# EAGLE design Anu-Control-revC (EAGLE 5.09)
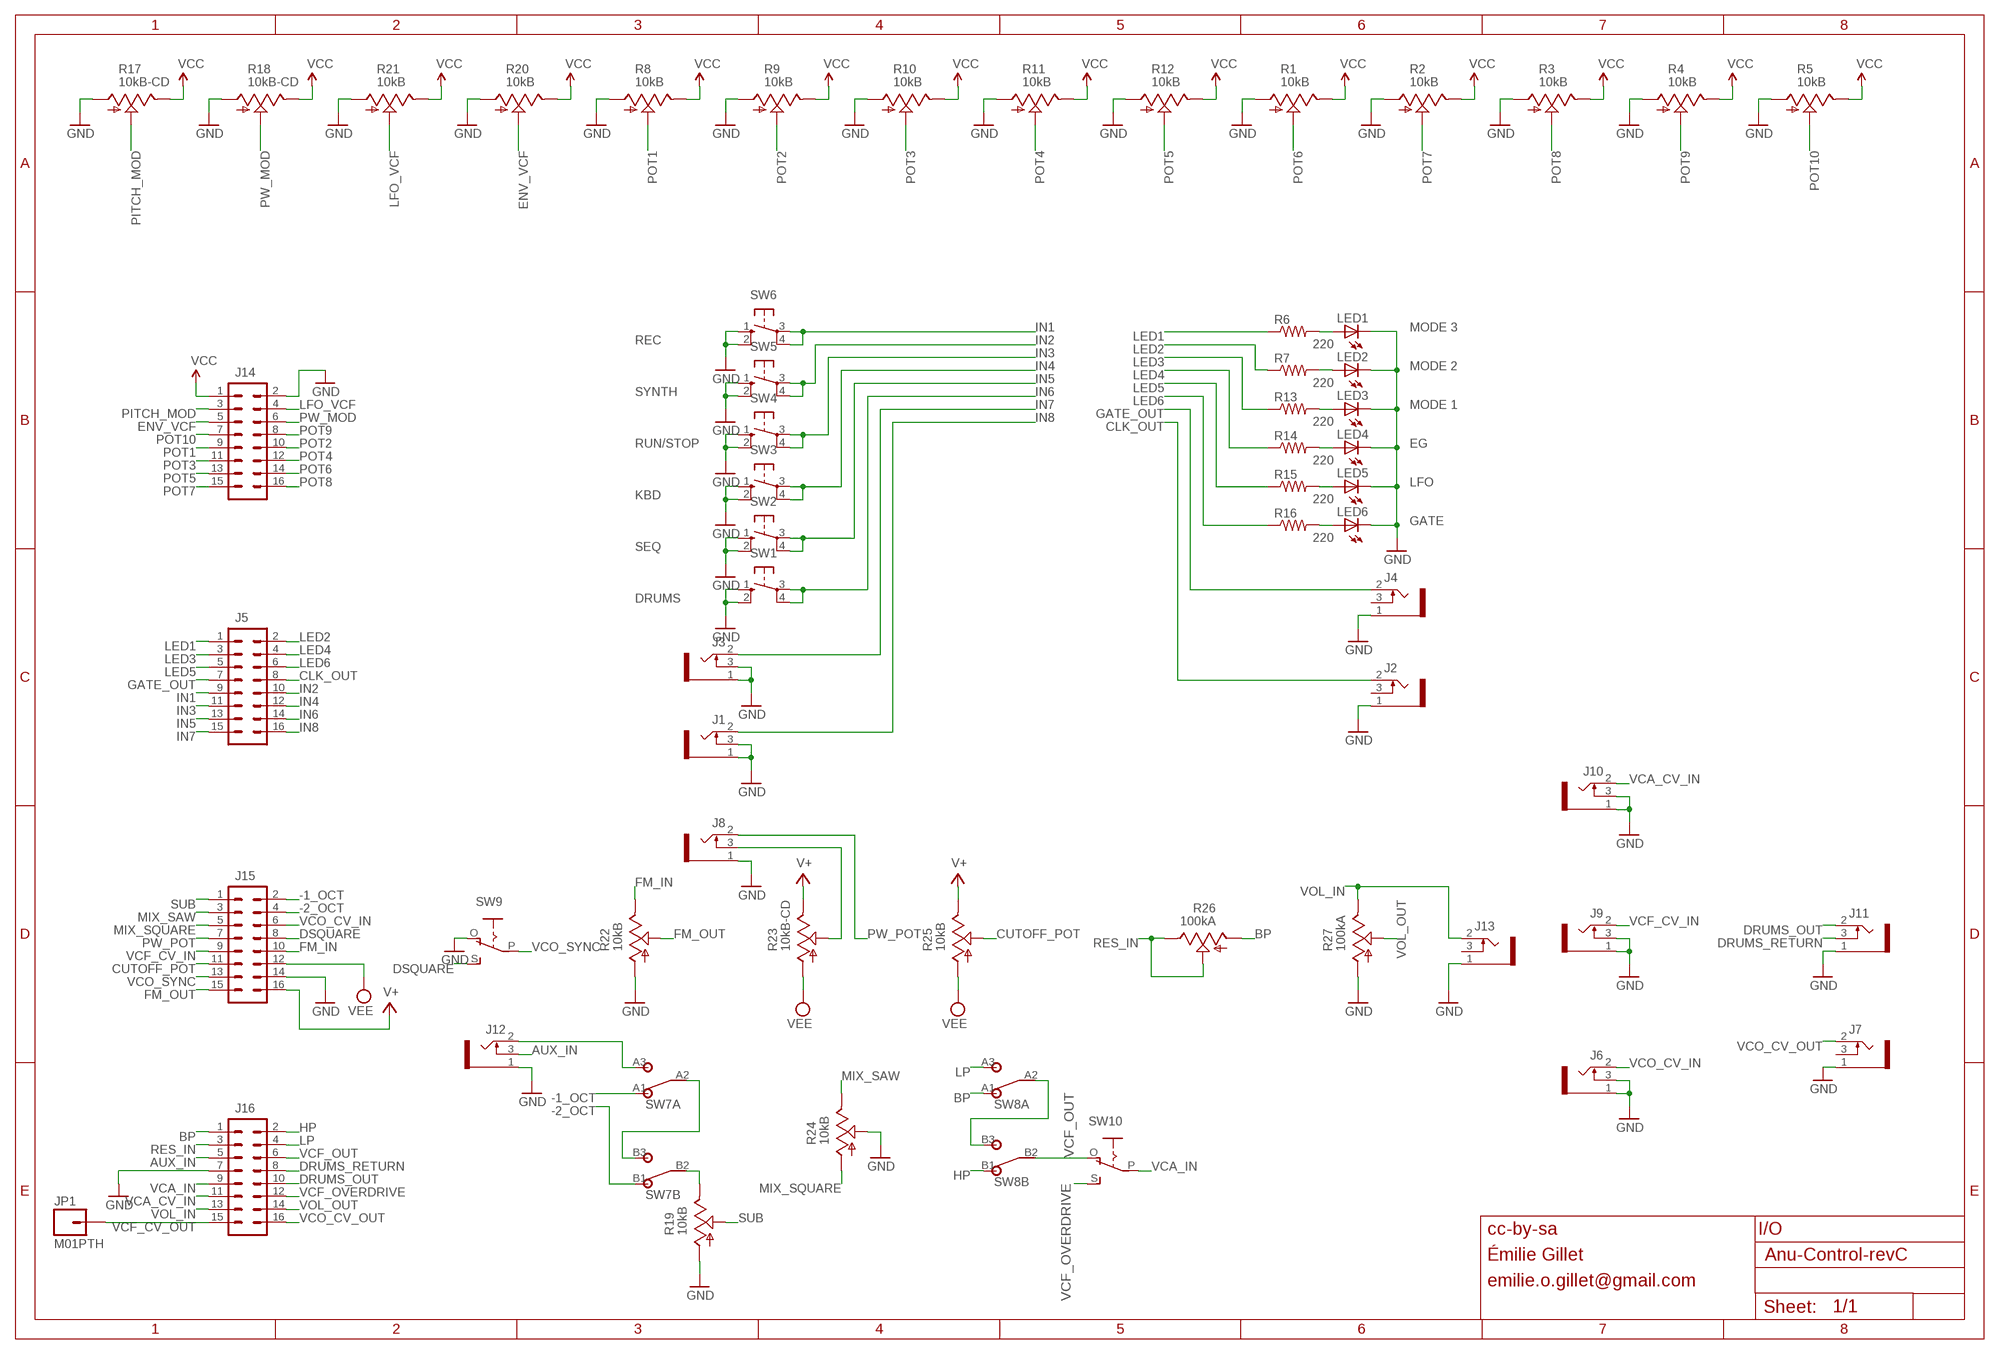
[diagram p0: schematic, sheet 1]

## Parts
J1  1502_03SLOTTED  [1502_03_SLOTTED]
J2  1502_03SLOTTED  [1502_03_SLOTTED]
J3  1502_03SLOTTED  [1502_03_SLOTTED]
J4  1502_03SLOTTED  [1502_03_SLOTTED]
J5  M08X2  [2X8]
J6  1502_03SLOTTED  [1502_03_SLOTTED]
J7  1502_03SLOTTED  [1502_03_SLOTTED]
J8  1502_03SLOTTED  [1502_03_SLOTTED]
J9  1502_03SLOTTED  [1502_03_SLOTTED]
J10  1502_03SLOTTED  [1502_03_SLOTTED]
J11  1502_03SLOTTED  [1502_03_SLOTTED]
J12  1502_03SLOTTED  [1502_03_SLOTTED]
J13  1502_03SLOTTED  [1502_03_SLOTTED]
J14  M08X2  [2X8]
J15  M08X2  [2X8]
J16  M08X2  [2X8]
JP1  M01PTH  [1X01]
LED1  LED3MM  [LED3MM]
LED2  LED3MM  [LED3MM]
LED3  LED3MM  [LED3MM]
LED4  LED3MM  [LED3MM]
LED5  LED3MM  [LED3MM]
LED6  LED3MM  [LED3MM]
R1  10kB  POT_USVERTICAL  [ALPS_POT_VERTICAL]
R2  10kB  POT_USVERTICAL  [ALPS_POT_VERTICAL]
R3  10kB  POT_USVERTICAL  [ALPS_POT_VERTICAL]
R4  10kB  POT_USVERTICAL  [ALPS_POT_VERTICAL]
R5  10kB  POT_USVERTICAL  [ALPS_POT_VERTICAL]
R6  220  R-US_0204/7  [0204/7]
R7  220  R-US_0204/7  [0204/7]
R8  10kB  POT_USVERTICAL  [ALPS_POT_VERTICAL]
R9  10kB  POT_USVERTICAL  [ALPS_POT_VERTICAL]
R10  10kB  POT_USVERTICAL  [ALPS_POT_VERTICAL]
R11  10kB  POT_USVERTICAL  [ALPS_POT_VERTICAL]
R12  10kB  POT_USVERTICAL  [ALPS_POT_VERTICAL]
R13  220  R-US_0204/7  [0204/7]
R14  220  R-US_0204/7  [0204/7]
R15  220  R-US_0204/7  [0204/7]
R16  220  R-US_0204/7  [0204/7]
R17  10kB-CD  POT_USVERTICAL  [ALPS_POT_VERTICAL]
R18  10kB-CD  POT_USVERTICAL  [ALPS_POT_VERTICAL]
R19  10kB  POT_USVERTICAL  [ALPS_POT_VERTICAL]
R20  10kB  POT_USVERTICAL  [ALPS_POT_VERTICAL]
R21  10kB  POT_USVERTICAL  [ALPS_POT_VERTICAL]
R22  10kB  POT_USVERTICAL  [ALPS_POT_VERTICAL]
R23  10kB-CD  POT_USVERTICAL  [ALPS_POT_VERTICAL]
R24  10kB  POT_USVERTICAL  [ALPS_POT_VERTICAL]
R25  10kB  POT_USVERTICAL  [ALPS_POT_VERTICAL]
R26  100kA  POT_USVERTICAL  [ALPS_POT_VERTICAL]
R27  100kA  POT_USVERTICAL  [ALPS_POT_VERTICAL]
SW1  40-XX  [B3F-40XX]
SW2  40-XX  [B3F-40XX]
SW3  40-XX  [B3F-40XX]
SW4  40-XX  [B3F-40XX]
SW5  40-XX  [B3F-40XX]
SW6  40-XX  [B3F-40XX]
SW7  DPDT2MD6T2B2M2RE  [DPDT_MINI]
SW8  DPDT2MD6T2B2M2RE  [DPDT_MINI]
SW9  EG1218S  [EG1218]
SW10  EG1218S  [EG1218]

## Nets
-1_OCT: J15.2 SW7.A1
-2_OCT: J15.4 SW7.B1
AUX_IN: J12.3 J16.5
BP: J16.1 R26.P$3(A) SW8.A1
CLK_OUT: J2.2 J5.8
CUTOFF_POT: J15.11 R25.P$2(S)
DRUMS_OUT: J11.2 J16.10
DRUMS_RETURN: J11.3 J16.8
DSQUARE: J15.8 SW9.S
ENV_VCF: J14.5 R20.P$2(S)
FM_IN: J15.10 R22.P$1(E)
FM_OUT: J15.15 R22.P$2(S)
GATE_OUT: J4.2 J5.7
GND: J1.1 J1.3 J2.1 J3.1 J3.3 J4.1 J6.1 J6.3 J7.1 J8.1 J9.1 J9.3 J10.1 J10.3 J11.1 J12.1 J13.1 J14.2 J15.14 J16.7 LED1.K(C) LED2.K(C) LED3.K(C) LED4.K(C) LED5.K(C) LED6.K(C) R1.P$3(A) R2.P$3(A) R3.P$3(A) R4.P$3(A) R5.P$3(A) R8.P$3(A) R9.P$3(A) R10.P$3(A) R11.P$3(A) R12.P$3(A) R17.P$3(A) R18.P$3(A) R19.P$3(A) R20.P$3(A) R21.P$3(A) R22.P$3(A) R24.P$2(S) R27.P$3(A) SW1.1(S) SW1.2(S1) SW2.1(S) SW2.2(S1) SW3.1(S) SW3.2(S1) SW4.1(S) SW4.2(S1) SW5.1(S) SW5.2(S1) SW6.1(S) SW6.2(S1) SW9.O
HP: J16.2 SW8.B1
IN1: J5.9 SW6.3(P) SW6.4(P1)
IN2: J5.10 SW5.3(P) SW5.4(P1)
IN3: J5.11 SW4.3(P) SW4.4(P1)
IN4: J5.12 SW3.3(P) SW3.4(P1)
IN5: J5.13 SW2.3(P) SW2.4(P1)
IN6: J5.14 SW1.3(P) SW1.4(P1)
IN7: J3.2 J5.15
IN8: J1.2 J5.16
LED1: J5.1 R6.1
LED2: J5.2 R7.1
LED3: J5.3 R13.1
LED4: J5.4 R14.1
LED5: J5.5 R15.1
LED6: J5.6 R16.1
LFO_VCF: J14.4 R21.P$2(S)
LP: J16.4 SW8.A3
MIX_SAW: J15.3 R24.P$1(E)
MIX_SQUARE: J15.5 R24.P$3(A)
N$1: J8.3 R23.P$2(S)
N$2: R19.P$1(E) SW7.B2
N$10: J12.2 SW7.A3
N$36: SW8.A2 SW8.B3
N$42: LED1.A R6.2
N$43: LED2.A R7.2
N$44: LED3.A R13.2
N$45: LED4.A R14.2
N$46: LED5.A R15.2
N$47: LED6.A R16.2
N$65: SW7.A2 SW7.B3
PITCH_MOD: J14.3 R17.P$2(S)
POT1: J14.9 R8.P$2(S)
POT2: J14.10 R9.P$2(S)
POT3: J14.11 R10.P$2(S)
POT4: J14.12 R11.P$2(S)
POT5: J14.13 R12.P$2(S)
POT6: J14.14 R1.P$2(S)
POT7: J14.15 R2.P$2(S)
POT8: J14.16 R3.P$2(S)
POT9: J14.8 R4.P$2(S)
POT10: J14.7 R5.P$2(S)
PW_MOD: J14.6 R18.P$2(S)
PW_POT: J8.2 J15.7
RES_IN: J16.3 R26.P$1(E) R26.P$2(S)
SUB: J15.1 R19.P$2(S)
V+: J15.16 R23.P$1(E) R25.P$1(E)
VCA_CV_IN: J10.2 J16.11
VCA_IN: J16.9 SW10.P
VCC: J14.1 R1.P$1(E) R2.P$1(E) R3.P$1(E) R4.P$1(E) R5.P$1(E) R8.P$1(E) R9.P$1(E) R10.P$1(E) R11.P$1(E) R12.P$1(E) R17.P$1(E) R18.P$1(E) R20.P$1(E) R21.P$1(E)
VCF_CV_IN: J9.2 J15.9
VCF_CV_OUT: J16.15 JP1.1
VCF_OUT: J16.6 SW8.B2 SW10.O
VCF_OVERDRIVE: J16.12 SW10.S
VCO_CV_IN: J6.2 J15.6
VCO_CV_OUT: J7.2 J16.16
VCO_SYNC: J15.13 SW9.P
VEE: J15.12 R23.P$3(A) R25.P$3(A)
VOL_IN: J13.2 J16.13 R27.P$1(E)
VOL_OUT: J16.14 R27.P$2(S)
Unconnected: J2.3 J4.3 J7.3 J13.3

## Notes on the sheet
- MODE 3
- REC
- MODE 2
- SYNTH
- MODE 1
- RUN/STOP | EG
- LFO
- KBD
- GATE
- SEQ
- DRUMS
- cc-by-sa | I/O
- Émilie Gillet
- emilie.o.gillet@gmail.com

## Library data of the parts
J1-J4 J6-J13 = og-lumberg:1502_03
J5 J14-J16 = SparkFun:M08X2
JP1 = SparkFun:M01: Header 1 Standard 1-pin 0.1" header. Use with straight break away headers (SKU : PRT-00116), right angle break away headers (PRT-00553), swiss pins (PRT-00743), machine pins (PRT-00117), and female headers (PRT-00115).
LED1-LED6 = led:LED: LED OSRAM: - CHIPLED LG R971, LG N971, LY N971, LG Q971, LY Q971, LO R971, LY R971 LH N974, LH R974 LS Q976, LO Q976, LY Q976 LO Q996 - Hyper CHIPLED LW Q18S LB Q993, LB Q99A, LB R99A - SideLED LS A670, LO A670, LY A670, LG A670, LP A670 LB A673, LV A673, LT A673, LW A673 LH A674 LY A675 LS A676, LA A676, LO A676, LY A676, LW A676 LS A679, LY A679, LG A679 - Hyper Micro SIDELED® LS Y876, LA Y876, LO Y876, LY Y876 LT Y87S - SmartLED LW L88C, LW L88S LB L89C, LB L89S, LG L890 LS L89K, LO L89K, LY L89K LS L896, LA L896, LO L896, LY L896 - TOPLED LS T670, LO T670, LY T670, LG T670, LP T670 LSG T670, LSP T670, LSY T670, LOP T670, LYG T670 LG T671, LOG T671, LSG T671 LB T673, LV T673, LT T673, LW T673 LH T674 LS T676, LA T676, LO T676, LY T676, LB T676, LH T676, LSB T676, LW T676 LB T67C, LV T67C, LT T67C, LS T67K, LO T67K, LY T67K, LW E67C LS E67B, LA E67B, LO E67B, LY E67B, LB E67C, LV E67C, LT E67C LW T67C LS T679, LY T679, LG T679 LS T770, LO T770, LY T770, LG T770, LP T770 LB T773, LV T773, LT T773, LW T773 LH T774 LS E675, LA E675, LY E675, LS T675 LS T776, LA T776, LO T776, LY T776, LB T776 LHGB T686 LT T68C, LB T68C - Hyper Mini TOPLED® LB M676 - Mini TOPLED Santana® LG M470 LS M47K, LO M47K, LY M47K Source: http://www.osram.convergy.de LUXEON: - LUMILED® LXK2-PW12-R00, LXK2-PW12-S00, LXK2-PW14-U00, LXK2-PW14-V00 LXK2-PM12-R00, LXK2-PM12-S00, LXK2-PM14-U00 LXK2-PE12-Q00, LXK2-PE12-R00, LXK2-PE12-S00, LXK2-PE14-T00, LXK2-PE14-U00 LXK2-PB12-K00, LXK2-PB12-L00, LXK2-PB12-M00, LXK2-PB14-N00, LXK2-PB14-P00, LXK2-PB14-Q00 LXK2-PR12-L00, LXK2-PR12-M00, LXK2-PR14-Q00, LXK2-PR14-R00 LXK2-PD12-Q00, LXK2-PD12-R00, LXK2-PD12-S00 LXK2-PH12-R00, LXK2-PH12-S00 LXK2-PL12-P00, LXK2-PL12-Q00, LXK2-PL12-R00 Source: www.luxeon.com KINGBRIGHT: KA-3528ASYC Source: www.kingbright.com
R1-R5 R8-R12 R17-R27 = pot-alps:POT_US
R6 R7 R13-R16 = rcl:R-US_: RESISTOR, American symbol
SW1-SW6 = og-switch:40-XX: OMRON SWITCH
SW7 SW8 = og-switch:DPDT
SW9 SW10 = adafruit:EG1218: SLIDING SWITCH 0.1" spacing through hole, vertical SPDT slide switch http://www.ladyada.net/library/pcb/eaglelibrary.html

## Board
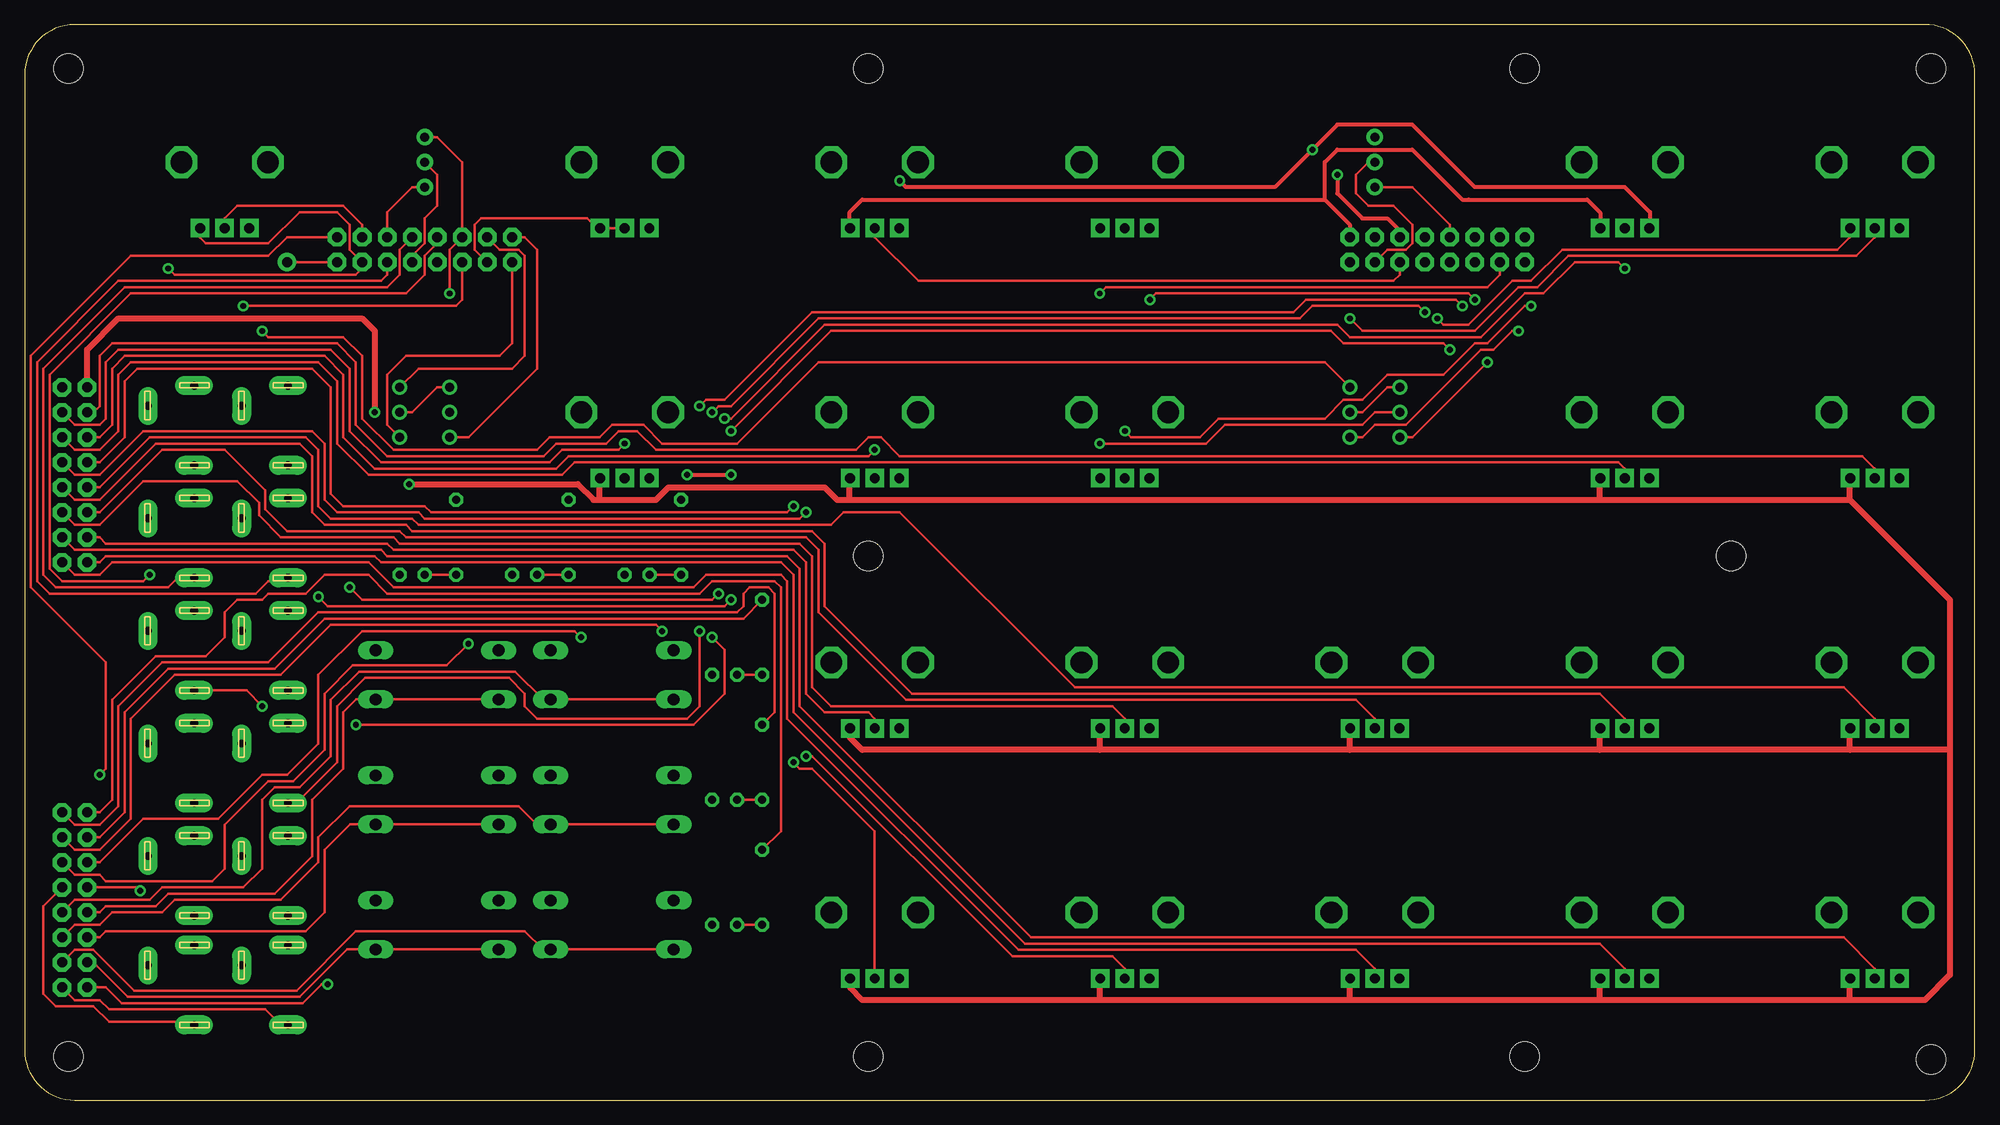
[diagram p1: board, top side]
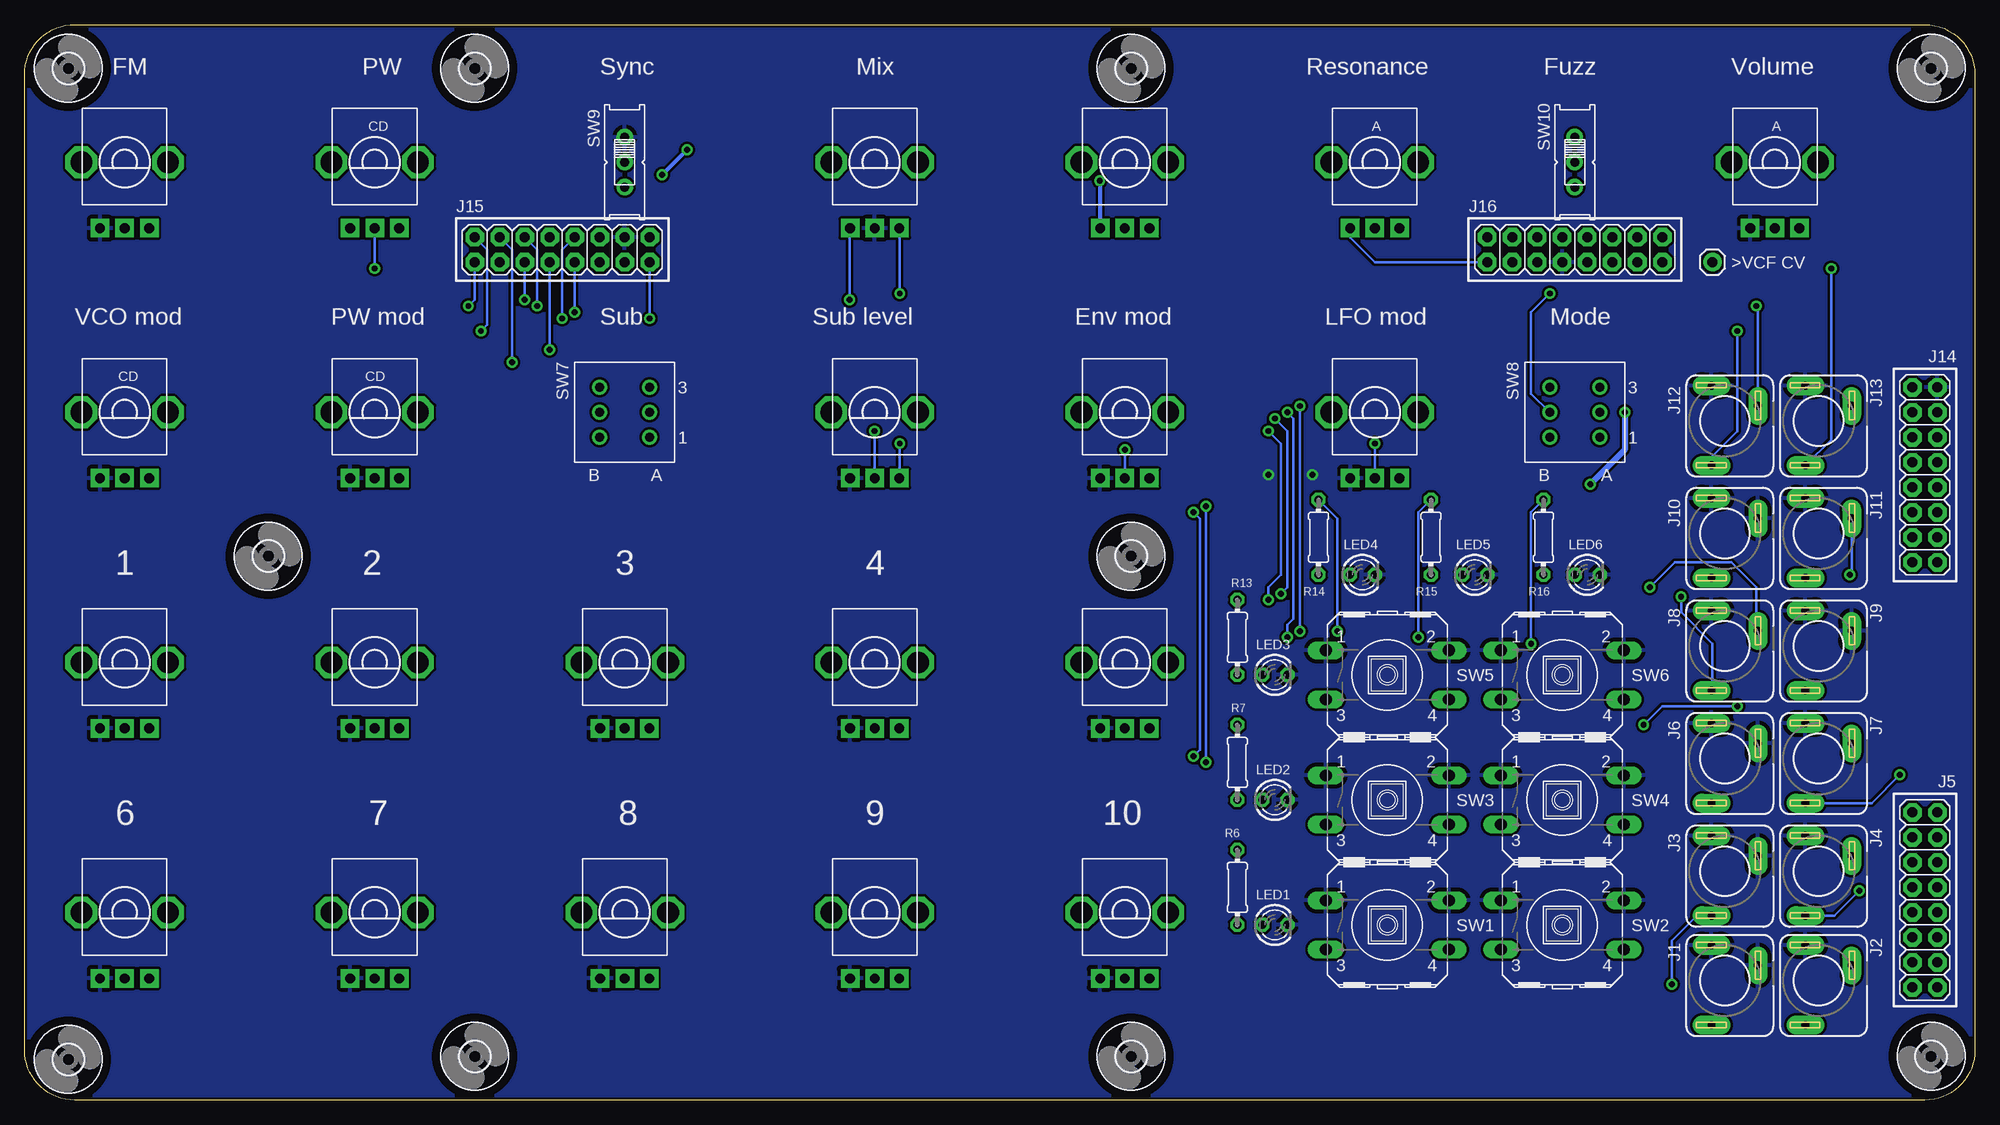
[diagram p2: board, bottom side, seen from below]

Size 198.12 x 109.22 mm. Coordinates in mm from the lower left corner, seen from the top.
Outline: 5.08,109.22 arc90 0,104.14 0,5.08 arc90 5.08,0 193.04,0 arc90 198.12,5.08 198.12,104.14 arc90 193.04,109.22 5.08,109.22
Copper layers (1*16): Top 0.035mm / dielectric 1.5mm / Bottom 0.035mm
Design rules "SparkFun *": minimum track width 8mil, minimum drill 20mil, track to track 8mil, track to pad 8mil, pad to pad 8mil, via to via 8mil, smd to smd 8mil, copper to edge 10mil, drill to drill 8mil, minimum pad ring 12mil, minimum via ring 10mil, stop-mask expansion 4mil, vias tented up to drill 25mil, thermal gap 16mil

### Footprints (pad centres in the part's own frame; a part is rotated, then mirrored left to right if it is on the bottom)
1502_03_SLOTTED = drill 0.8 pad 1.93 long: 1 1.35,-3.34; 2 1.35,4.76; 3 -3.35,-1.29
2X8 = drill 1.016 pad 1.88 octagon: 1 0,0; 2 0,2.54; 3 2.54,0; 4 2.54,2.54; 5 5.08,0; 6 5.08,2.54; 7 7.62,0; 8 7.62,2.54; 9 10.16,0; 10 10.16,2.54; 11 12.7,0; 12 12.7,2.54; 13 15.24,0; 14 15.24,2.54; 15 17.78,0; 16 17.78,2.54
1X01 = drill 1.016 pad 1.88 round: 1 0,0
LED3MM = drill 0.813 octagon: A -1.27,0; K 1.27,0
ALPS_POT_VERTICAL = drill 1 pad 1.88 square: P$1 -2.5,6.7; P$2 0,6.7; P$3 2.5,6.7 | drill 2.2 pad 3.175 octagon: P$4 -4.4,0; P$5 4.4,0
0204/7 = drill 0.813 octagon: 1 -3.81,0; 2 3.81,0
B3F-40XX = drill 1.194 long: 1 -6.248,2.489; 2 6.248,2.489; 3 -6.248,-2.489; 4 6.248,-2.489
DPDT_MINI = drill 0.9 round: A1 -2.54,2.54; A2 -2.54,0; A3 -2.54,-2.54; B1 2.54,2.54; B2 2.54,0; B3 2.54,-2.54
EG1218 = drill 0.9 pad 1.676 round: O -2.54,0; P 0,0; S 2.54,0
3,0 = hole 3: 0,0

### Placement (x,y rotation side)
J1  25.4,12.38 180 bottom
J2  15.88,12.38 180 bottom
J3  25.4,23.5 180 bottom
J4  15.88,23.5 180 bottom
J5  6.35,29.21 270 bottom
J6  25.4,34.92 180 bottom
J7  15.88,34.92 180 bottom
J8  25.4,46.35 180 bottom
J9  15.88,46.35 180 bottom
J10  25.4,57.78 180 bottom
J11  15.88,57.78 180 bottom
J12  25.4,69.22 180 bottom
J13  15.88,69.22 180 bottom
J14  6.35,72.39 270 bottom
J15  152.4,85.09 0 bottom
J16  49.53,85.09 0 bottom
JP1  26.67,85.09 0 bottom
LED1  71.12,17.78 0 bottom
LED2  71.12,30.48 0 bottom
LED3  71.12,43.18 0 bottom
LED4  62.23,53.34 0 bottom
LED5  50.8,53.34 0 bottom
LED6  39.37,53.34 0 bottom
R1  187.96,19.05 180 bottom
R2  162.56,19.05 180 bottom
R3  137.16,19.05 180 bottom
R4  111.76,19.05 180 bottom
R5  86.36,19.05 180 bottom
R6  74.93,21.59 270 bottom
R7  74.93,34.29 270 bottom
R8  187.96,44.45 180 bottom
R9  162.56,44.45 180 bottom
R10  137.16,44.45 180 bottom
R11  111.76,44.45 180 bottom
R12  86.36,44.45 180 bottom
R13  74.93,46.99 270 bottom
R14  66.67,57.15 270 bottom
R15  55.24,57.15 270 bottom
R16  43.81,57.15 270 bottom
R17  187.96,69.85 180 bottom
R18  162.56,69.85 180 bottom
R19  111.76,69.85 180 bottom
R20  86.36,69.85 180 bottom
R21  60.96,69.85 180 bottom
R22  187.96,95.25 180 bottom
R23  162.56,95.25 180 bottom
R24  111.76,95.25 180 bottom
R25  86.36,95.25 180 bottom
R26  60.96,95.25 180 bottom
R27  20.32,95.25 180 bottom
SW1  59.69,17.78 0 bottom
SW2  41.91,17.78 0 bottom
SW3  59.69,30.48 0 bottom
SW4  41.91,30.48 0 bottom
SW5  59.69,43.18 0 bottom
SW6  41.91,43.18 0 bottom
SW7  137.16,69.85 180 bottom
SW8  40.64,69.85 180 bottom
SW9  137.16,95.25 270 bottom
SW10  40.64,95.25 270 bottom
U$1  [3,0]  193.68,4.13 0 bottom
U$2  [3,0]  152.4,4.45 0 bottom
U$3  [3,0]  85.72,4.45 0 bottom
U$4  [3,0]  4.45,4.45 0 bottom
U$5  [V2_LOGO_ANUSHRI_CONTROL_BOARD]  82.23,0.64 0 bottom
U$6  [3,0]  173.35,55.24 0 bottom
U$7  [3,0]  85.72,55.24 0 bottom
U$8  [3,0]  193.68,104.78 0 bottom
U$9  [3,0]  152.4,104.78 0 bottom
U$10  [3,0]  85.72,104.78 0 bottom
U$11  [3,0]  4.45,104.78 0 bottom

### Tracks (layer width: path | path; a pad name or v marks a point on that pad's centre or on a via)
-1_OCT  (via drill 0.6)
  Top 0.254: SW7.A1 135.89,67.31 137.16,68.58 140.34,68.58 147.96,76.2 149.22,76.2 151.13,78.11 v151.76,78.11
  Bottom 0.254: v151.76,78.11 151.13,78.74 151.13,86.36 J15.2
-2_OCT  (via drill 0.6)
  Top 0.254: SW7.B1 140.97,67.31 v148.59,74.93
  Bottom 0.254: v148.59,74.93 148.59,86.36 J15.4
AUX_IN  (via drill 0.6)
  Top 0.254: v22.23,80.64 43.81,80.64 44.45,81.28 J16.5
  Bottom 0.254: v22.23,80.64 22.05,80.47 J12.3
BP
  Top 0.254: SW8.A1 36.83,68.58 36.83,73.66 38.73,75.56 48.26,75.56 49.53,76.83 J16.1
  Bottom 0.254: J16.1 60.96,85.09 63.46,87.59 R26.P$3
CLK_OUT
  Top 0.254: J5.8 1.91,19.68 1.91,10.79 3.17,9.53 6.99,9.53 8.57,7.94 16.19,7.94 16.51,7.62 J2.2
CUTOFF_POT
  Top 0.254: R25.P$2 86.36,87.63 90.81,83.19 139.06,83.19 139.7,83.82 J15.11
DRUMS_OUT
  Top 0.254: J16.10 38.1,86.36 38.1,83.82 36.83,82.55 10.16,82.55 1.91,74.3 1.91,53.34 3.17,52.07 14.61,52.07 15.56,53.02 J11.2
DRUMS_RETURN  (via drill 0.6)
  Top 0.254: v12.7,53.34 12.06,52.7 3.81,52.7 2.54,53.98 2.54,73.66 10.79,81.92 38.73,81.92 40.64,83.82 40.64,85.72 41.91,87 J16.8
  Bottom 0.254: v12.7,53.34 12.53,53.52 J11.3
DSQUARE
  Top 0.254: J15.8 144.78,88.9 140.97,92.71 SW9.S
ENV_VCF  (via drill 0.6)
  Top 0.254: v86.36,66.04 85.72,65.41 55.24,65.41 53.98,64.14 35.56,64.14 32.38,67.31 32.38,73.66 30.48,75.56 10.16,75.56 8.89,74.3 8.89,68.58 7.62,67.31 J14.5
  Bottom 0.254: v86.36,66.04 R20.P$2
FM_IN  (via drill 0.6)
  Top 0.254: R22.P$1 185.42,88.51 185.42,87.63 184.15,86.36 156.21,86.36 153.03,83.19 151.13,83.19 146.69,78.74 144.15,78.74 v143.51,79.38
  Bottom 0.254: v143.51,79.38 143.51,86.36 J15.10
FM_OUT  (via drill 0.6)
  Top 0.254: R22.P$2 187.96,87.63 186.06,85.72 156.84,85.72 153.67,82.55 151.76,82.55 147.32,78.11 135.89,78.11 v134.62,79.38
  Bottom 0.254: v134.62,79.38 J15.15
GATE_OUT  (via drill 0.6)
  Top 0.254: J5.7 11.43,21.59 v11.75,21.27
  Bottom 0.254: v11.75,21.27 14.29,18.73 J4.2
GND  (via drill 0.6)
  Top 0.406: v67.31,63.5 v71.75,63.5
  pour Bottom (isolate 0.254): 193.04,0 arc90 198.12,5.08 198.12,104.14 arc90 193.04,109.22 5.08,109.22 arc90 0,104.14 0,5.08 arc90 5.08,0
HP
  Top 0.254: SW8.B1 45.09,67.31 52.07,74.3 52.07,86.36 50.8,87.63 J16.2
IN1
  Top 0.254: SW6.3 SW6.4 33.71,40.69 32.38,39.37 32.38,33.66 29.21,30.48 29.21,24.77 25.4,20.95 14.61,20.95 13.34,19.68 8.26,19.68 7.62,19.05 J5.9
IN2
  Top 0.254: SW5.3 SW5.4 52.65,40.69 49.85,43.5 33.97,43.5 31.11,40.64 31.11,34.92 27.94,31.75 25.4,31.75 24.13,30.48 24.13,23.5 22.23,21.59 13.97,21.59 12.7,20.32 5.08,20.32 J5.10
IN3
  Top 0.254: SW4.3 SW4.4 33.07,27.99 30.48,25.4 30.48,19.05 28.57,17.14 8.26,17.14 7.62,16.51 J5.11
IN4
  Top 0.254: SW3.3 SW3.4 52.02,27.99 50.16,29.84 33.02,29.84 29.84,26.67 29.84,24.13 26.04,20.32 15.24,20.32 13.97,19.05 8.89,19.05 7.62,17.78 5.08,17.78 J5.12
IN5
  Top 0.254: SW2.3 SW2.4 32.75,15.29 27.94,10.48 10.48,10.48 6.99,13.97 J5.13
IN6
  Top 0.254: SW1.4 SW1.3 | SW1.4 53.29,15.29 | SW1.4 52.65,15.29 50.8,17.14 33.66,17.14 27.62,11.11 11.11,11.11 6.99,15.24 5.08,15.24 J5.14
IN7  (via drill 0.6)
  Top 0.254: J5.15 8.26,11.43 9.84,9.84 28.26,9.84 30.16,11.75 v30.8,11.75
  Bottom 0.254: v30.8,11.75 30.8,16.19 28.25,18.73 J3.2
IN8
  Top 0.254: J5.16 5.08,10.16 7.62,10.16 8.57,9.21 24.45,9.21 26.03,7.62 J1.2
LED1
  Top 0.254: R6.1 76.83,27.3 76.83,52.07 76.2,52.7 69.85,52.7 68.58,51.44 36.83,51.44 34.92,53.34 30.48,53.34 28.57,51.44 24.77,51.44 24.13,50.8 21.59,50.8 20.32,49.53 20.32,46.99 18.41,45.09 13.34,45.09 8.89,40.64 8.89,30.48 7.62,29.21 J5.1
LED2
  Top 0.254: R7.1 76.2,39.37 76.2,51.44 75.56,52.07 73.66,52.07 73.03,51.44 73.03,50.16 72.39,49.53 29.84,49.53 24.77,44.45 13.97,44.45 9.53,40.01 9.53,29.84 7.62,27.94 5.08,27.94 J5.2
LED3
  Top 0.254: R13.1 73.03,48.9 30.48,48.9 25.4,43.81 14.61,43.81 10.16,39.37 10.16,29.21 7.62,26.67 J5.3
LED4  (via drill 0.6)
  Top 0.254: v64.77,47.62 64.14,48.26 31.11,48.26 26.04,43.18 15.24,43.18 10.79,38.73 10.79,28.57 7.62,25.4 5.08,25.4 J5.4
  Bottom 0.254: v64.77,47.62 64.77,59.05 R14.1
LED5  (via drill 0.6)
  Top 0.254: v56.52,46.99 55.88,47.62 34.29,47.62 29.84,43.18 29.84,36.2 26.67,33.02 24.13,33.02 19.68,28.57 12.06,28.57 7.62,24.13 J5.5
  Bottom 0.254: v56.52,46.99 56.52,59.69 R15.1
LED6  (via drill 0.6)
  Top 0.254: J5.6 5.08,22.86 7.62,22.86 8.26,22.23 19.05,22.23 20.32,23.5 20.32,27.94 24.77,32.38 27.3,32.38 30.48,35.56 30.48,41.27 33.34,44.13 42.86,44.13 v45.09,46.35
  Bottom 0.254: v45.09,46.35 45.09,59.69 R16.1
LFO_VCF  (via drill 0.6)
  Top 0.254: v60.96,66.67 60.33,66.04 54.61,66.04 53.34,64.77 36.2,64.77 33.02,67.94 33.02,74.3 31.11,76.2 9.53,76.2 8.26,74.93 8.26,69.22 7.62,68.58 5.08,68.58 J14.4
  Bottom 0.254: v60.96,66.67 R21.P$2
LP
  Top 0.254: SW8.A3 40.01,74.3 49.53,74.3 50.8,75.56 50.8,85.72 50.16,86.36 48.26,86.36 J16.4
MIX_SAW  (via drill 0.6)
  Top 0.254: v109.22,81.92 109.86,82.55 148.59,82.55 149.86,83.82 J15.3
  Bottom 0.254: R24.P$1 109.22,88.51 v109.22,81.92
MIX_SQUARE  (via drill 0.6)
  Top 0.254: v114.3,81.28 114.94,81.92 146.69,81.92 v147.32,81.28
  Bottom 0.254: R24.P$3 114.3,88.51 v114.3,81.28 | v147.32,81.28 J15.5
N$1  (via drill 0.6)
  Top 0.254: v33.02,52.07 34.29,50.8 69.85,50.8 v70.48,51.44 | v71.12,69.22 71.75,69.22 81.28,78.74 133.35,78.74 134.62,77.47 147.96,77.47 152.4,81.92 154.31,81.92 157.48,85.09 161.93,85.09 v162.56,84.45
  Bottom 0.254: J8.3 22.23,47.82 22.23,52.07 24.77,54.61 30.48,54.61 v33.02,52.07 | v70.48,51.44 69.85,52.07 69.85,67.94 v71.12,69.22 | v162.56,84.45 R23.P$2
N$2  (via drill 0.6)
  Top 0.254: SW7.B2 137.16,69.85 135.89,68.58 121.92,68.58 120.02,66.67 v109.22,66.67
  Bottom 0.254: R19.P$1 109.22,63.15 v109.22,66.67
N$10  (via drill 0.6)
  Top 0.254: SW7.A3 132.08,74.93 80.64,74.93 72.39,66.67 64.77,66.67 62.87,68.58 59.69,68.58 58.42,67.31 53.34,67.31 52.07,66.04 37.47,66.04 34.29,69.22 34.29,75.56 32.38,77.47 24.77,77.47 v24.13,78.11
  Bottom 0.254: J12.2 26.67,64.53 26.67,65.41 24.13,67.94 v24.13,78.11
N$36
  Top 0.254: SW8.A2 39.37,69.85 41.91,72.39 SW8.B3
N$42
  Top 0.254: LED1.A R6.2
N$43
  Top 0.254: LED2.A R7.2
N$44
  Top 0.254: LED3.A R13.2
N$45
  Top 0.254: LED4.A R14.2
N$46
  Top 0.254: LED5.A R15.2
N$47
  Top 0.254: LED6.A R16.2
N$65
  Top 0.254: SW7.A2 135.89,69.85 138.43,72.39 SW7.B3
PITCH_MOD
  Top 0.254: R17.P$2 187.96,64.14 186.69,65.41 88.9,65.41 87,67.31 85.72,67.31 84.45,66.04 64.14,66.04 62.23,67.94 60.33,67.94 59.05,66.67 53.98,66.67 52.7,65.41 36.83,65.41 33.66,68.58 33.66,74.93 31.75,76.83 8.89,76.83 7.62,75.56 7.62,70.48 6.99,69.85 J14.3
POT1
  Top 0.254: R8.P$2 187.96,38.73 184.78,41.91 106.68,41.91 88.9,59.69 83.19,59.69 81.92,58.42 40.01,58.42 39.37,59.05 31.11,59.05 29.84,60.33 29.84,66.04 28.57,67.31 12.7,67.31 7.62,62.23 J14.9
POT2
  Top 0.254: R9.P$2 162.56,38.73 160.02,41.27 90.17,41.27 81.28,50.16 81.28,56.52 80.01,57.78 39.37,57.78 38.73,58.42 30.48,58.42 29.21,59.69 29.21,65.41 27.94,66.67 13.34,66.67 7.62,60.96 5.08,60.96 J14.10
POT3
  Top 0.254: R10.P$2 137.16,38.73 135.25,40.64 89.53,40.64 80.64,49.53 80.64,55.88 79.38,57.15 38.73,57.15 38.1,57.78 26.67,57.78 24.45,60.01 24.45,61.91 20.32,66.04 13.97,66.04 7.62,59.69 J14.11
POT4
  Top 0.254: R11.P$2 111.76,38.73 110.49,40.01 81.92,40.01 80.01,41.91 80.01,55.24 78.74,56.52 38.1,56.52 37.47,57.15 26.04,57.15 23.81,59.37 23.81,60.64 21.59,62.87 12.06,62.87 7.62,58.42 5.08,58.42 J14.12
POT5
  Top 0.254: R12.P$2 86.36,38.73 85.72,39.37 81.28,39.37 79.38,41.27 79.38,54.61 78.11,55.88 37.47,55.88 36.83,56.52 8.26,56.52 7.62,57.15 J14.13
POT6
  Top 0.254: J14.14 5.08,55.88 36.2,55.88 36.83,55.24 77.47,55.24 78.74,53.98 78.74,40.01 102.23,16.51 184.78,16.51 187.96,13.34 R1.P$2
POT7
  Top 0.254: R2.P$2 162.56,13.34 160.02,15.88 101.6,15.88 78.11,39.37 78.11,53.34 76.83,54.61 36.2,54.61 35.56,55.24 8.26,55.24 7.62,54.61 J14.15
POT8
  Top 0.254: J14.16 5.08,53.34 7.62,53.34 8.89,54.61 34.92,54.61 37.47,52.07 67.94,52.07 69.22,53.34 76.83,53.34 77.47,52.7 77.47,38.73 100.97,15.24 135.25,15.24 137.16,13.34 R3.P$2
POT9  (via drill 0.6)
  Top 0.254: J14.8 5.08,63.5 7.62,63.5 12.06,67.94 29.21,67.94 30.48,66.67 30.48,60.96 31.75,59.69 40.01,59.69 40.64,59.05 78.74,59.05 v79.38,59.69 | R4.P$2 111.76,13.34 110.49,14.61 100.33,14.61 80.01,34.92 v79.38,34.92
  Bottom 0.254: v79.38,59.69 78.74,59.05 78.74,35.56 v79.38,34.92
POT10  (via drill 0.6)
  Top 0.254: J14.7 7.62,64.77 10.16,67.31 10.16,73.03 11.43,74.3 29.21,74.3 31.11,72.39 31.11,61.59 32.38,60.33 40.64,60.33 41.27,59.69 77.47,59.69 v78.11,60.33 | R5.P$2 86.36,27.3 80.01,33.66 78.74,33.66 v78.11,34.29
  Bottom 0.254: v78.11,60.33 v78.11,34.29
PW_MOD
  Top 0.254: R18.P$2 162.56,64.14 161.93,64.77 55.88,64.77 54.61,63.5 34.92,63.5 31.75,66.67 31.75,73.03 29.84,74.93 10.79,74.93 9.53,73.66 9.53,67.94 7.62,66.04 5.08,66.04 J14.6
PW_POT  (via drill 0.6)
  Top 0.254: v29.84,51.12 30.8,50.16 71.12,50.16 v71.75,50.8 | v71.75,67.94 81.92,78.11 132.72,78.11 133.99,76.83 144.15,76.83 v144.78,76.2
  Bottom 0.254: v29.84,51.12 29.84,49.53 26.67,46.35 26.67,41.91 26.75,41.83 J8.2 | v71.75,50.8 71.75,52.07 70.48,53.34 70.48,66.67 v71.75,67.94 | v144.78,76.2 J15.7
RES_IN
  Top 0.254: R26.P$1 R26.P$2 | R26.P$1 58.07,88.55 | J16.3 45.72,86.36 45.72,88.9 46.35,89.53 57.15,89.53 58.13,88.55 R26.P$1
SUB  (via drill 0.6)
  Top 0.254: v153.03,80.64 152.4,80.64 148.59,76.83 147.32,76.83 144.15,73.66 138.43,73.66 135.89,71.12 133.99,71.12 132.08,69.22 121.28,69.22 119.38,67.31 112.39,67.31 v111.76,67.94
  Bottom 0.254: v153.03,80.64 152.4,81.28 J15.1 | R19.P$2 v111.76,67.94
V+
  Top 0.406: R25.P$1 83.82,88.59 83.82,90.17 85.09,91.44 132.08,91.44 | R23.P$1 160.06,90.13 158.75,91.44 146.69,91.44 146.05,91.44 140.97,96.52 133.35,96.52 132.08,95.25 132.08,91.44 | J15.16 134.62,88.9 132.08,91.44
VCA_CV_IN
  Top 0.254: J10.2 26.43,52.7 24.77,52.7 23.5,51.44 2.54,51.44 1.27,52.7 1.27,74.93 9.53,83.19 36.2,83.19 36.83,83.82 J16.11
VCA_IN
  Top 0.254: J16.9 39.37,85.72 40.64,87 40.64,89.53 41.91,90.81 41.91,93.98 SW10.P
VCC  (via drill 0.6)
  Top 0.61: R8.P$1 185.42,37.71 185.42,35.56 | 195.58,35.56 185.42,35.56 | 195.58,35.56 195.58,12.7 193.04,10.16 185.42,10.16 | 185.42,35.56 160.02,35.56 | 160.02,35.56 134.62,35.56 | R10.P$1 134.62,37.71 134.62,35.56 | R9.P$1 160.02,37.71 160.02,35.56 | 109.22,35.56 85.09,35.56 83.82,36.83 83.86,36.87 R12.P$1 | 134.62,35.56 109.22,35.56 | R11.P$1 109.22,37.71 109.22,35.56 | 83.82,60.96 160.02,60.96 | 83.82,60.96 82.55,60.96 81.28,62.23 65.41,62.23 64.14,60.96 58.42,60.96 | R20.P$1 83.82,63.11 83.82,60.96 | R18.P$1 160.02,63.11 160.02,60.96 | 195.58,35.56 195.58,50.8 185.42,60.96 | 160.02,60.96 185.42,60.96 | R17.P$1 185.42,63.11 185.42,60.96 | v39.05,62.55 56.2,62.55 57.78,60.96 58.42,60.96 | R21.P$1 58.42,63.11 58.42,60.96 | J14.1 6.35,76.2 9.53,79.38 34.29,79.38 35.56,78.11 v35.56,69.85 | 185.42,10.16 160.02,10.16 | 160.02,10.16 134.62,10.16 | 134.62,10.16 109.22,10.16 | 109.22,10.16 85.09,10.16 83.86,11.39 R5.P$1 | R4.P$1 109.22,12.31 109.22,10.16 | R3.P$1 134.62,12.31 134.62,10.16 | R2.P$1 160.02,12.31 160.02,10.16 | R1.P$1 185.42,12.31 185.42,10.16
  Bottom 0.61: v35.56,69.85 35.56,66.04 v39.05,62.55
VCF_CV_IN  (via drill 0.6)
  Top 0.254: v69.85,46.99 71.12,45.72 71.12,41.27 67.94,38.1 v33.66,38.1 | v69.85,69.85 70.48,70.48 71.75,70.48 80.64,79.38 129.54,79.38 130.81,80.64 141.6,80.64 v142.24,80.01 | v24.13,40.01 22.54,41.59 J9.2
  Bottom 0.254: v69.85,46.99 69.85,48.26 69.22,48.9 69.22,69.22 v69.85,69.85 | v142.24,80.01 J15.9 | v33.66,38.1 31.75,40.01 v24.13,40.01
VCF_CV_OUT
  Top 0.254: JP1.1 J16.15
VCF_OUT  (via drill 0.6)
  Top 0.254: SW10.O 41.91,97.79 44.45,95.25 J16.6 43.18,86.36 v43.18,81.92
  Bottom 0.254: v43.18,81.92 45.09,80.01 45.09,71.75 SW8.B2
VCF_OVERDRIVE
  Top 0.254: J16.12 36.83,90.17 39.37,92.71 SW10.S
VCO_CV_IN  (via drill 0.6)
  Top 0.254: v68.58,70.48 69.22,71.12 71.12,71.12 80.01,80.01 128.91,80.01 130.18,81.28 145.41,81.28 v146.05,80.64 | J6.2 27.07,30.48 27.94,30.48 31.75,34.29 31.75,40.01 34.61,42.86 49.21,42.86 50.8,41.27 50.8,40.01 52.07,38.73 67.31,38.73 68.58,40.01 v68.58,47.62
  Bottom 0.254: v68.58,47.62 v68.58,70.48 | v146.05,80.64 146.05,86.36 J15.6
VCO_CV_OUT  (via drill 0.6)
  Top 0.254: J16.16 26.67,87.63 24.77,85.72 10.79,85.72 0.64,75.56 0.64,52.07 8.26,44.45 8.26,33.66 v7.62,33.02
  Bottom 0.254: v7.62,33.02 10.47,30.16 J7.2
VCO_SYNC
  Top 0.254: J15.13 138.43,86.36 140.34,86.36 140.97,87 140.97,88.9 139.06,90.81 136.53,90.81 135.25,92.08 135.25,93.98 136.53,95.25 SW9.P
VEE  (via drill 0.6)
  Top 0.406: R23.P$3 165.1,88.59 165.1,90.17 162.56,92.71 147.32,92.71 140.97,99.06 133.35,99.06 v130.81,96.52 127,92.71 89.53,92.71 v88.9,93.34 | J15.12 139.7,88.27 138.43,89.53 135.89,89.53 133.35,92.08 v133.35,93.98
  Bottom 0.406: v88.9,93.34 88.86,93.31 R25.P$3 | v130.81,96.52 v133.35,93.98
VOL_IN  (via drill 0.6)
  Top 0.254: R27.P$1 17.78,88.51 17.78,87.63 18.41,87 24.77,87 27.94,90.17 31.75,90.17 33.02,88.9 33.02,86.36 J16.13 34.29,84.45 33.66,83.82 15.24,83.82 v14.61,84.45
  Bottom 0.254: J13.2 14.61,67.08 v14.61,84.45
VOL_OUT
  Top 0.254: J16.14 34.29,88.9 32.38,90.81 21.59,90.81 20.32,89.53 R27.P$2

### Text on the board
bNames: Volume | Fuzz | Resonance | Mix | Sync | PW | FM | A | A | CD | >VCF CV | Mode | LFO mod | Env mod | Sub level | Sub | PW mod | VCO mod | CD | CD | 4 | 3 | 2 | 1 | 10 | 9 | 8 | 7 | 6
200bmp: cc-by-sa, Émilie Gillet, 2012. rev. C